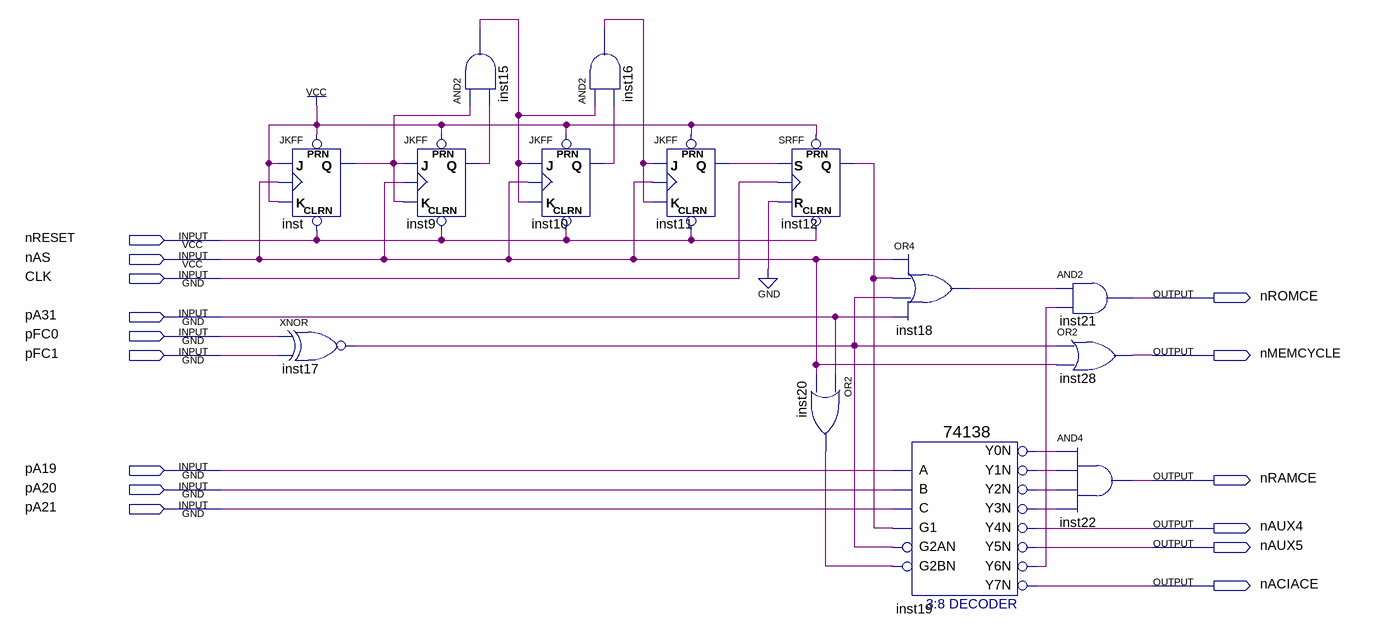
[diagram p0: schematic sheet]
// Quartus schematic BusDecode030.bdf as structural Verilog: 14 symbols, 15 pins
module BusDecode030 (
  input  nRESET,
  input  nAS,
  input  CLK,
  input  pA31,
  input  pFC0,
  input  pFC1,
  input  pA19,
  input  pA20,
  input  pA21,
  output nROMCE,
  output nMEMCYCLE,
  output nRAMCE,
  output nAUX4,
  output nAUX5,
  output nACIACE
);

  wire inst9_q, inst10_q, inst11_q, inst12_q, inst15_out, inst16_out, inst17_out, inst18_out, inst19_y0n,
       inst19_y1n, inst19_y2n, inst19_y3n, inst19_y6n, inst20_out, inst_q;

  JKFF inst (.PRN(1'b1), .CLRN(nRESET), .K(1'b1), .J(1'b1), .CLK(nAS), .Q(inst_q));
  xnor inst17 (inst17_out, pFC0, pFC1);
  and inst15 (inst15_out, inst_q, inst9_q);
  JKFF inst9 (.PRN(1'b1), .CLRN(nRESET), .K(inst_q), .J(inst_q), .CLK(nAS), .Q(inst9_q));
  JKFF inst10 (.PRN(1'b1), .CLRN(nRESET), .K(inst15_out), .J(inst15_out), .CLK(nAS), .Q(inst10_q));
  and inst16 (inst16_out, inst15_out, inst10_q);
  JKFF inst11 (.PRN(1'b1), .CLRN(nRESET), .K(inst16_out), .J(inst16_out), .CLK(nAS), .Q(inst11_q));
  SRFF inst12 (.PRN(1'b1), .CLRN(nRESET), .S(inst11_q), .R(1'b0), .CLK(CLK), .Q(inst12_q));
  or inst20 (inst20_out, pA31, nAS);
  or inst18 (inst18_out, nAS, inst12_q, inst17_out, pA31);
  \74138  inst19 (
    .A(pA19), .B(pA20), .G1(inst12_q), .C(pA21), .G2AN(inst17_out), .G2BN(inst20_out), .Y0N(inst19_y0n),
    .Y1N(inst19_y1n), .Y2N(inst19_y2n), .Y3N(inst19_y3n), .Y4N(nAUX4), .Y5N(nAUX5), .Y6N(inst19_y6n),
    .Y7N(nACIACE));
  and inst21 (nROMCE, inst18_out, inst19_y6n);
  or inst28 (nMEMCYCLE, inst17_out, nAS);
  and inst22 (nRAMCE, inst19_y0n, inst19_y1n, inst19_y2n, inst19_y3n);
endmodule
